# EAGLE design smallscale (EAGLE 6.4)

## Sheet 1 of 2
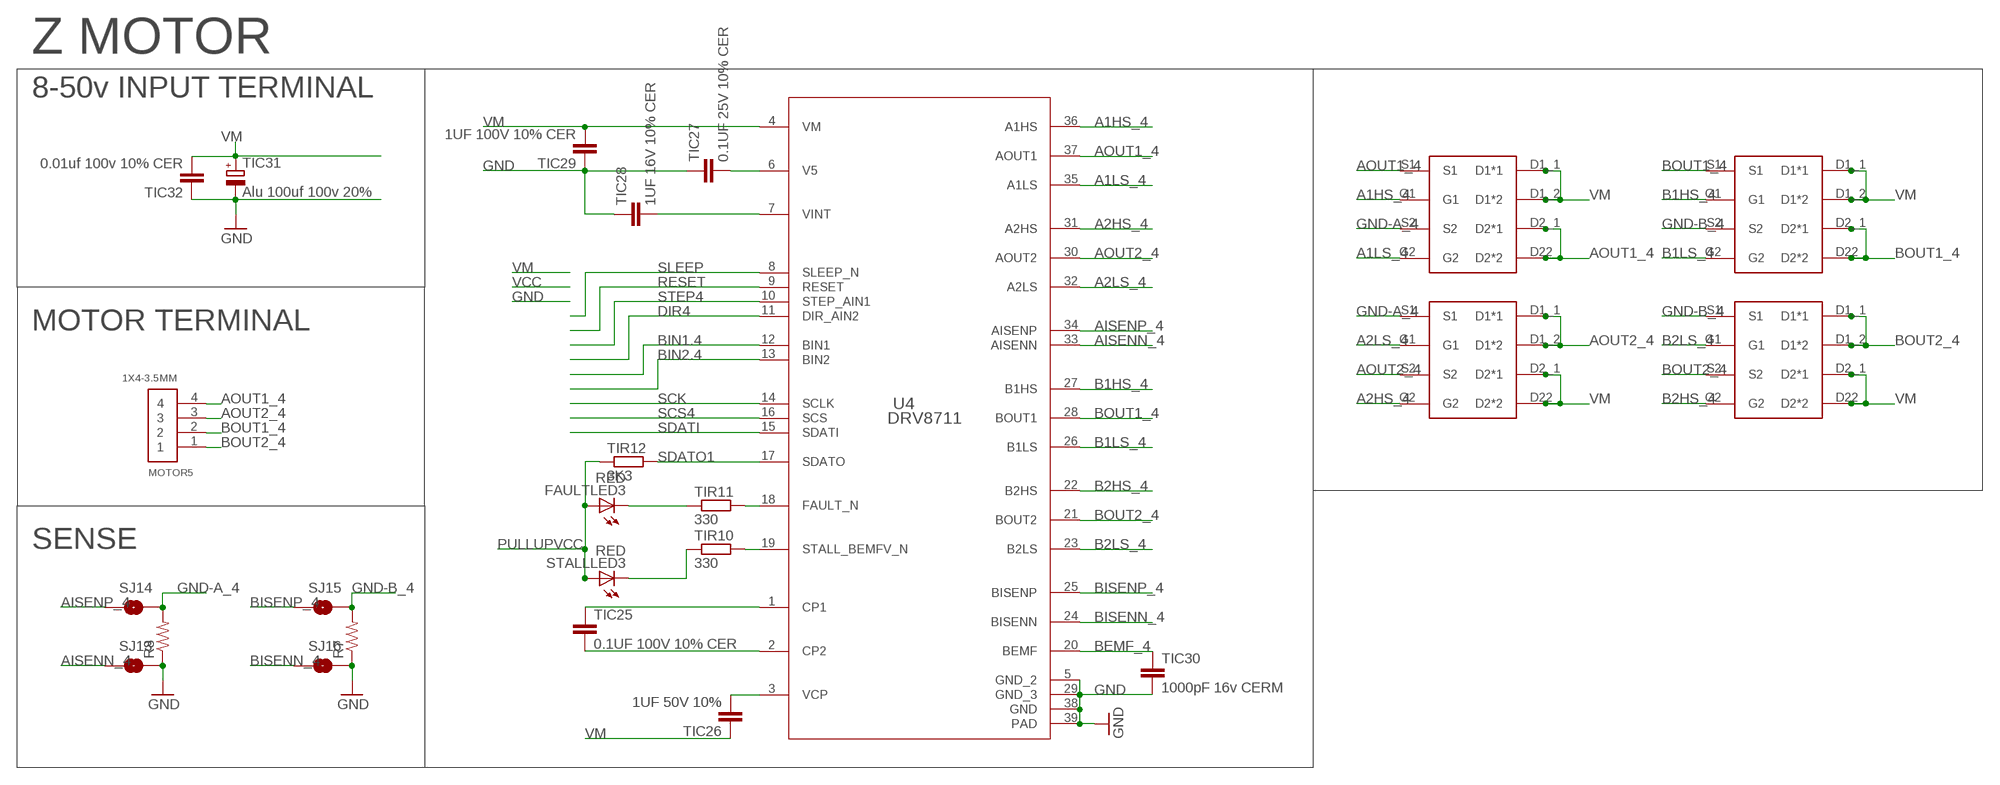
[diagram p0: schematic, sheet 1]

### Parts
FAULTLED3  RED  LEDSMT1206  [1206]
MOTOR5  1X4-3.5MM  [1X04-3.5MM]
R7  R-US_R2512  [R2512]
R8  R-US_R2512  [R2512]
SJ13  SOLDERJUMPERTRACE  [SJ_2S-TRACE]
SJ14  SOLDERJUMPERTRACE  [SJ_2S-TRACE]
SJ15  SOLDERJUMPERTRACE  [SJ_2S-TRACE]
SJ16  SOLDERJUMPERTRACE  [SJ_2S-TRACE]
STALLLED3  RED  LEDSMT1206  [1206]
TIC25  0.1UF 100V 10% CER  C-EUC0603K  [C0603K]
TIC26  1UF 50V 10%  C-EUC0805K  [C0805K]
TIC27  0.1UF 25V 10% CER  C-EUC0603K  [C0603K]
TIC28  1UF 16V 10% CER  C-EUC0603K  [C0603K]
TIC29  1UF 100V 10% CER  C-EUC1206K  [C1206K]
TIC30  1000pF 16v CERM  C-EUC0603K  [C0603K]
TIC31  Alu 100uf 100v 20%  CPOL-EUE5-10.5  [E5-10,5]
TIC32  0.01uf 100v 10% CER  C-EUC0603K  [C0603K]
TIR10  330  R-EU_R1206  [R1206]
TIR11  330  R-EU_R1206  [R1206]
TIR12  3K3  R-EU_R1206  [R1206]
U4  DRV8711  DRV8711DCPR  [DCP0038A_N]
U$13  CSD88537ND  [CSD88537ND]
U$14  CSD88537ND  [CSD88537ND]
U$15  CSD88537ND  [CSD88537ND]
U$16  CSD88537ND  [CSD88537ND]

### Nets
A1HS_4: U4.36(A1HS) U$13.G1
A1LS_4: U4.35(A1LS) U$13.G2
A2HS_4: U4.31(A2HS) U$15.G2
A2LS_4: U4.32(A2LS) U$15.G1
AISENN_4: SJ13.1 U4.33(AISENN)
AISENP_4: SJ14.1 U4.34(AISENP)
AOUT1_4: MOTOR5.4 U4.37(AOUT1) U$13.D2_1(D2*1) U$13.D22(D2*2) U$13.S1
AOUT2_4: MOTOR5.3 U4.30(AOUT2) U$15.D1_1(D1*1) U$15.D1_2(D1*2) U$15.S2
B1HS_4: U4.27(B1HS) U$14.G1
B1LS_4: U4.26(B1LS) U$14.G2
B2HS_4: U4.22(B2HS) U$16.G2
B2LS_4: U4.23(B2LS) U$16.G1
BEMF_4: TIC30.1 U4.20(BEMF)
BIN1.4: U4.12(BIN1)
BIN2.4: U4.13(BIN2)
BISENN_4: SJ16.1 U4.24(BISENN)
BISENP_4: SJ15.1 U4.25(BISENP)
BOUT1_4: MOTOR5.2 U4.28(BOUT1) U$14.D2_1(D2*1) U$14.D22(D2*2) U$14.S1
BOUT2_4: MOTOR5.1 U4.21(BOUT2) U$16.D1_1(D1*1) U$16.D1_2(D1*2) U$16.S2
CP1_4: TIC25.1 U4.1(CP1)
CP2_4: TIC25.2 U4.2(CP2)
DIR4: U4.11(DIR_AIN2)
FAULT_N4: TIR11.2 U4.18(FAULT_N)
FAULTLED4: FAULTLED3.C TIR11.1
GND: R7.1 R8.1 SJ13.2 SJ16.2 TIC27.1 TIC28.1 TIC29.1 TIC30.2 TIC31.- TIC32.1 U4.5(GND_2) U4.29(GND_3) U4.38(GND) U4.39(PAD) ; also sheet 2
GND-A_4: R8.2 SJ14.2 U$13.S2 U$15.S1
GND-B_4: R7.2 SJ15.2 U$14.S2 U$16.S1
PULLUPVCC: FAULTLED3.A STALLLED3.A TIR12.1
RESET: U4.9(RESET)
SCK: U4.14(SCLK)
SCS4: U4.16(SCS)
SDATI: U4.15(SDATI)
SDATO1: TIR12.2 U4.17(SDATO)
SLEEP: U4.8(SLEEP_N)
STALL_N4: TIR10.2 U4.19(STALL_BEMFV_N)
STALLLED4: STALLLED3.C TIR10.1
STEP4: U4.10(STEP_AIN1)
V5_4: TIC27.2 U4.6(V5)
VCP4: TIC26.2 U4.3(VCP)
VINT4: TIC28.2 U4.7(VINT)
VM: TIC26.1 TIC29.2 TIC31.+ TIC32.2 U4.4(VM) U$13.D1_1(D1*1) U$13.D1_2(D1*2) U$14.D1_1(D1*1) U$14.D1_2(D1*2) U$15.D2_1(D2*1) U$15.D22(D2*2) U$16.D2_1(D2*1) U$16.D22(D2*2) ; also sheet 2

### Notes on the sheet
- Z MOTOR
- 8-50v INPUT TERMINAL
- MOTOR TERMINAL
- SENSE

## Sheet 2 of 2
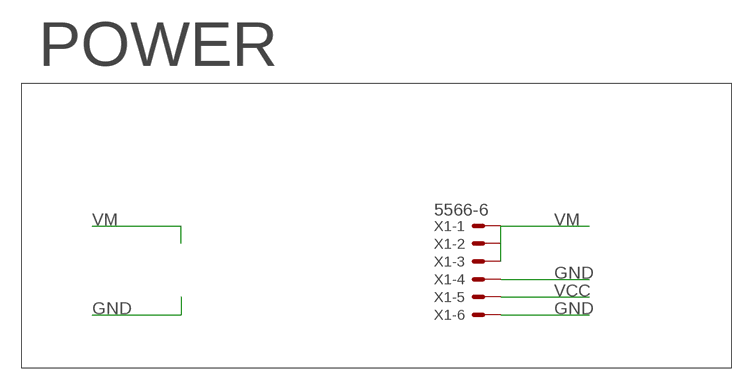
[diagram p1: schematic, sheet 2]

### Parts
X1  5566-6  [5566-6]

### Nets
GND: X1.4 X1.6 ; also sheet 1
VCC: X1.5 ; also sheet 1
VM: X1.1 X1.2 X1.3 ; also sheet 1

### Notes on the sheet
- POWER

## Library data of the parts
FAULTLED3 STALLLED3 = led:LED: LED OSRAM: - CHIPLED LG R971, LG N971, LY N971, LG Q971, LY Q971, LO R971, LY R971 LH N974, LH R974 LS Q976, LO Q976, LY Q976 LO Q996 - Hyper CHIPLED LW Q18S LB Q993, LB Q99A, LB R99A - SideLED LS A670, LO A670, LY A670, LG A670, LP A670 LB A673, LV A673, LT A673, LW A673 LH A674 LY A675 LS A676, LA A676, LO A676, LY A676, LW A676 LS A679, LY A679, LG A679 - Hyper Micro SIDELED® LS Y876, LA Y876, LO Y876, LY Y876 LT Y87S - SmartLED LW L88C, LW L88S LB L89C, LB L89S, LG L890 LS L89K, LO L89K, LY L89K LS L896, LA L896, LO L896, LY L896 - TOPLED LS T670, LO T670, LY T670, LG T670, LP T670 LSG T670, LSP T670, LSY T670, LOP T670, LYG T670 LG T671, LOG T671, LSG T671 LB T673, LV T673, LT T673, LW T673 LH T674 LS T676, LA T676, LO T676, LY T676, LB T676, LH T676, LSB T676, LW T676 LB T67C, LV T67C, LT T67C, LS T67K, LO T67K, LY T67K, LW E67C LS E67B, LA E67B, LO E67B, LY E67B, LB E67C, LV E67C, LT E67C LW T67C LS T679, LY T679, LG T679 LS T770, LO T770, LY T770, LG T770, LP T770 LB T773, LV T773, LT T773, LW T773 LH T774 LS E675, LA E675, LY E675, LS T675 LS T776, LA T776, LO T776, LY T776, LB T776 LHGB T686 LT T68C, LB T68C - Hyper Mini TOPLED® LB M676 - Mini TOPLED Santana® LG M470 LS M47K, LO M47K, LY M47K Source: http://www.osram.convergy.de LUXEON: - LUMILED® LXK2-PW12-R00, LXK2-PW12-S00, LXK2-PW14-U00, LXK2-PW14-V00 LXK2-PM12-R00, LXK2-PM12-S00, LXK2-PM14-U00 LXK2-PE12-Q00, LXK2-PE12-R00, LXK2-PE12-S00, LXK2-PE14-T00, LXK2-PE14-U00 LXK2-PB12-K00, LXK2-PB12-L00, LXK2-PB12-M00, LXK2-PB14-N00, LXK2-PB14-P00, LXK2-PB14-Q00 LXK2-PR12-L00, LXK2-PR12-M00, LXK2-PR14-Q00, LXK2-PR14-R00 LXK2-PD12-Q00, LXK2-PD12-R00, LXK2-PD12-S00 LXK2-PH12-R00, LXK2-PH12-S00 LXK2-PL12-P00, LXK2-PL12-Q00, LXK2-PL12-R00 Source: www.luxeon.com KINGBRIGHT: KA-3528ASYC Source: www.kingbright.com
MOTOR5 = adafruit:1X4: 4-pin connector
R7 R8 = adafruit:R-US_: RESISTOR, American symbol
SJ13-SJ16 = SparkFun:SOLDERJUMPER: Solder Jumper Standard SMD solder jumper. Used to automate production. Two varients : Normally Open and Normally Closed are the same, but have different paste layers. NC will have a large amount of paste and should jumper during reflow.
TIC25-TIC30 TIC32 = rcl:C-EU: CAPACITOR, European symbol
TIC31 = resistor:CPOL-EU: POLARIZED CAPACITOR, European symbol
TIR10-TIR12 = rcl:R-EU_: RESISTOR, European symbol
U4 = tidrv8711:DRV8711DCPR; ALTERNATEPARTNUMBER: DRV8711DCP; COMPTYPE: IC; MANUFACTURER: Texas Instruments; MOUNTTYPE: SMT; PACKAGEREFERENCE: DCP0038A; PARTNUMBER: DRV8711DCPR; PIN_COUNT: 39; REFDES: RefDes; ROHS: Y; TYPE: TYPE; VALUE: Value
U$13-U$16 = tidrv8711:CSD88537ND
X1 = con-molex:5566-6: Mini FIT connector 6 pol Source: http://www.molex.com; MPN: 95566-61002; OC_FARNELL: unknown; OC_NEWARK: 22K8620

## Board
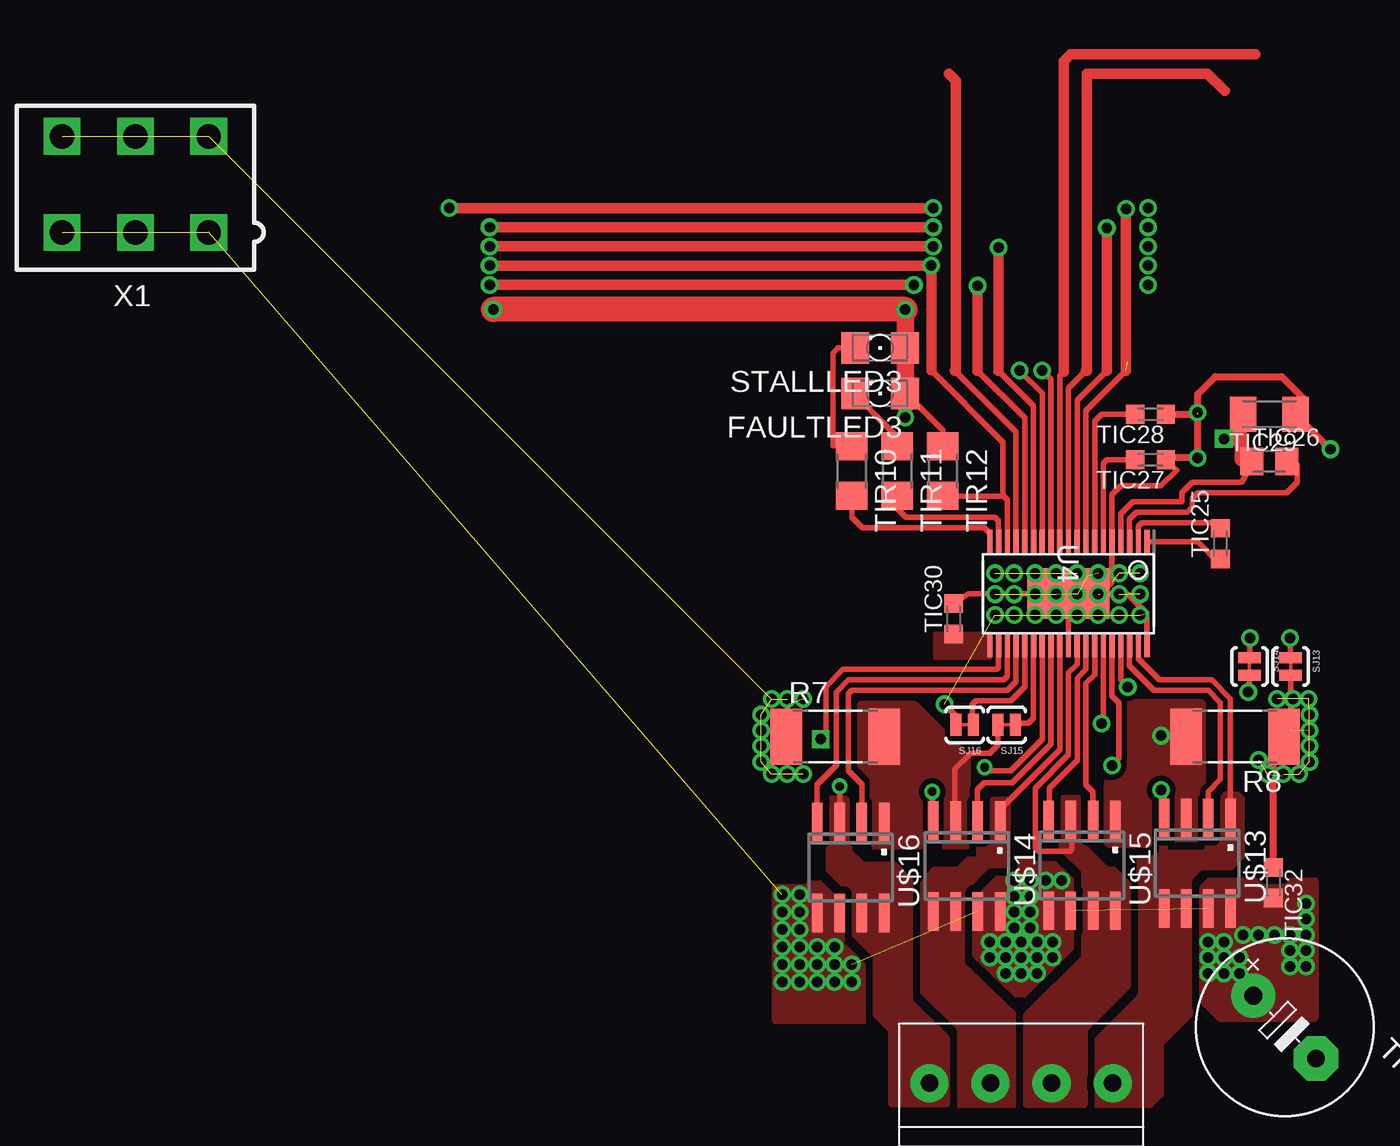
[diagram p2: board, top side]
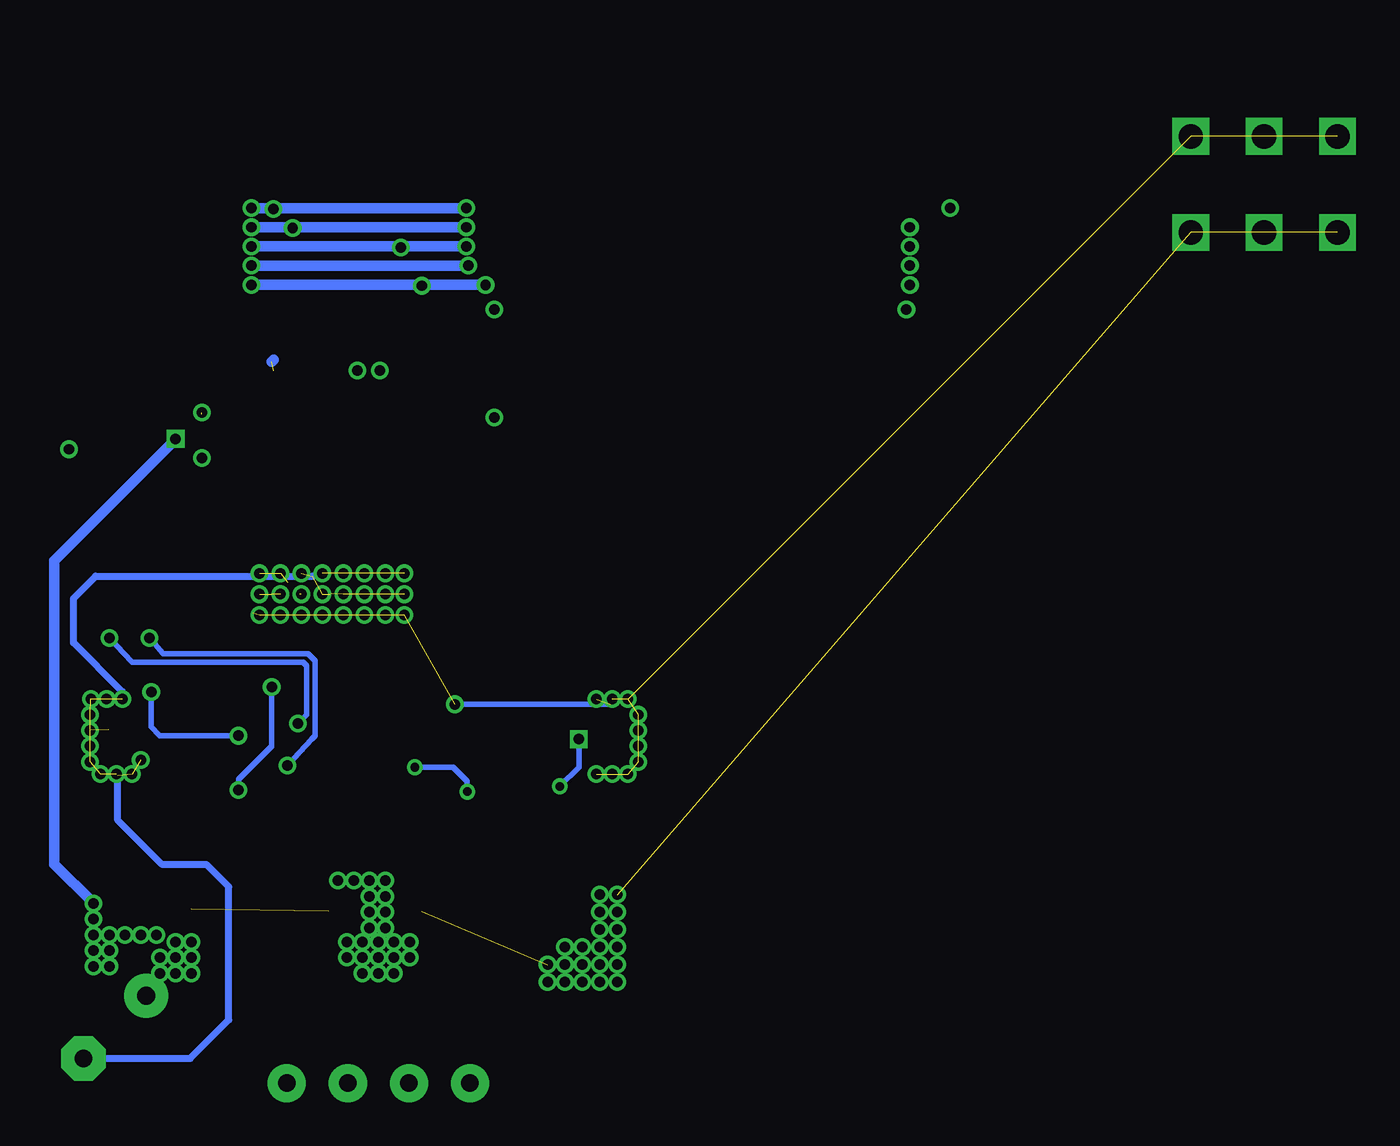
[diagram p3: board, bottom side, seen from below]

No outline drawn. Coordinates in mm, seen from the top.
Copper layers (1*16): Top 0.035mm / dielectric 1.5mm / Bottom 0.035mm
Design rules "default": minimum track width 10mil, minimum drill 24mil, track to track 8mil, track to pad 8mil, pad to pad 8mil, via to via 8mil, smd to smd 8mil, copper to edge 40mil, drill to drill 8mil, minimum pad ring 10mil, minimum via ring 8mil, stop-mask expansion 4mil, vias tented up to drill 0mil, thermal gap 10mil

### Footprints (pad centres in the part's own frame; a part is rotated, then mirrored left to right if it is on the bottom)
1206 = smd 1.6 x 1.803: A -1.422,0; C 1.422,0
1X04-3.5MM = drill 1 pad 2.184: 1 -5.25,0; 2 -1.75,0; 3 1.75,0; 4 5.25,0
R2512 = smd 1.8 x 3.2: 1 -2.8,0; 2 2.8,0
SJ_2S-TRACE = smd 0.635 x 1.27: 1 -0.508,0; 2 0.508,0
C0603K = smd 1.05 x 1.08: 1 -0.875,0; 2 0.875,0
C0805K = smd 1.3 x 1.6: 1 -1,0; 2 1,0
C1206K = smd 1.5 x 2: 1 -1.5,0; 2 1.5,0
E5-10,5 = drill 1.016 pad 2.54: + -2.54,0 | drill 1.016 pad 2.54 octagon: - 2.54,0
R1206 = smd 1.6 x 1.803: 1 -1.422,0; 2 1.422,0
DCP0038A_N = smd 1.397 x 0.305: 1 -2.95,4.5; 2 -2.95,4; 3 -2.95,3.5; 4 -2.95,3; 5 -2.95,2.5; 6 -2.95,2; 7 -2.95,1.5; 8 -2.95,1; 9 -2.95,0.5; 10 -2.95,0; 11 -2.95,-0.5; 12 -2.95,-1; 13 -2.95,-1.5; 14 -2.95,-2; 15 -2.95,-2.5; 16 -2.95,-3; 17 -2.95,-3.5; 18 -2.95,-4; 19 -2.95,-4.5; 20 2.95,-4.5; 21 2.95,-4; 22 2.95,-3.5; 23 2.95,-3; 24 2.95,-2.5; 25 2.95,-2; 26 2.95,-1.5; 27 2.95,-1; 28 2.95,-0.5; 29 2.95,0; 30 2.95,0.5; 31 2.95,1; 32 2.95,1.5; 33 2.95,2; 34 2.95,2.5; 35 2.95,3; 36 2.95,3.5; 37 2.95,4; 38 2.95,4.5 | smd 2.896 x 4.699: 39 0,0
CSD88537ND = smd 0.6 x 2.2: D1_1 0.635,6.41; D1_2 1.905,6.41; D2_1 3.175,6.41; D22 4.445,6.41; G1 1.905,1.21; G2 4.445,1.21; S1 0.635,1.21; S2 3.175,1.21
5566-6 = drill 1.4 square: 1 4.2,-2.75; 2 0,-2.75; 3 -4.2,-2.75; 4 4.2,2.75; 5 0,2.75; 6 -4.2,2.75

### Placement (x,y rotation side)
FAULTLED3  16.37,46.03 180 top
MOTOR5  24.45,6.54 0 top
R7  13.8,26.38 0 top
R8  36.7,26.38 180 top
SJ13  39.88,30.39 270 top
SJ14  37.53,30.39 270 top
SJ15  23.62,27.05 180 top
SJ16  21.22,27.05 180 top
STALLLED3  16.37,48.64 180 top
TIC25  35.86,37.43 90 top
TIC26  38.66,42.13 0 top
TIC27  31.86,42.23 180 top
TIC28  31.86,44.83 180 top
TIC29  38.66,44.83 180 top
TIC30  20.59,33.12 90 top
TIC31  39.54,9.75 315 top
TIC32  38.9,18.02 270 top
TIR10  14.75,41.59 270 top
TIR11  17.36,41.59 270 top
TIR12  19.97,41.59 270 top
U4  27.16,34.57 270 top
U$13  37.07,22.94 180 top
U$14  23.87,22.78 180 top
U$15  30.47,22.82 180 top
U$16  17.23,22.7 180 top
X1  -26.28,58 0 top

### Tracks (layer width: path | path; a pad name or v marks a point on that pad's centre or on a via)
A1HS_4
  Top 0.305: U$13.G1 35.16,23.23 35.86,23.93 35.86,28.33 35.16,29.03 32.06,29.03 30.66,30.43 30.66,32.22 U4.36
A1LS_4  (via drill 0.6)
  Top 0.305: U4.35 30.16,29.63 v30.56,29.23 | v32.46,23.33 32.46,23.13 32.66,22.93 32.66,21.77 U$13.G2
  Bottom 0.305: v30.56,29.23 30.56,25.83 32.46,23.93 v32.46,23.33
A2HS_4
  Top 0.305: U$15.G2 26.06,21.64 26.06,23.43 27.66,25.03 27.66,29.73 28.16,30.23 U4.31
A2LS_4
  Top 0.305: U4.32 28.66,29.93 28.16,29.43 28.16,23.63 28.56,23.23 U$15.G1
AISENN_4  (via drill 0.6)
  Top 0.305: U4.33 29.16,27.23 v29.06,27.13 | v39.86,32.03 39.86,30.92 SJ13.1
  Bottom 0.305: v39.86,32.03 38.56,30.63 28.76,30.63 28.56,30.43 28.56,27.63 v29.06,27.13
AISENP_4  (via drill 0.6)
  Top 0.305: v37.56,32.03 37.56,30.93 SJ14.1 | U4.34 29.66,28.73 30.06,28.33 30.06,25.13 v29.66,24.73
  Bottom 0.305: v37.56,32.03 36.76,31.13 28.46,31.13 28.06,30.73 28.06,26.43 28.26,26.23 v29.66,24.73
AOUT1_4
  Top 0.305: U$13.S1 36.44,28.55 35.36,29.63 32.36,29.63 31.16,30.83 U4.37
  pour Top (isolate 0.406, rank 3, no thermals): 36.86,23.03 36.16,23.03 35.96,22.83 35.96,20.23 35.66,19.93 31.26,19.93 31.26,11.83 28.66,9.03 28.66,5.33 31.86,5.33 32.46,5.93 32.46,8.83 34.56,10.93 34.56,14.83 34.36,15.03 34.36,18.33 34.86,18.83 36.36,18.83 37.06,19.53 37.06,22.83
AOUT2_4
  Top 0.305: U$15.S2 27.36,21.55 27.36,19.93 27.26,19.83 25.46,19.83 25.26,20.03 25.26,23.43 27.16,25.33 27.16,30.03 27.66,30.53 U4.30
  pour Top (isolate 0.406, no thermals): 27.76,22.83 26.86,22.83 26.76,22.73 26.76,20.03 28.06,18.73 28.06,13.73 24.76,10.43 24.76,5.33 28.06,5.33 28.06,9.63 30.56,12.13 30.56,17.93 29.76,18.73 29.36,18.73 27.96,20.13 27.96,22.63
B1HS_4
  Top 0.305: U4.27 26.16,25.93 23.96,23.73 22.36,23.73 21.96,23.33 U$14.G1
B1LS_4  (via drill 0.5)
  Top 0.305: U4.26 25.66,26.23 23.86,24.43 22.56,24.43 v22.36,24.63 | v19.36,23.23 19.36,21.64 U$14.G2
  Bottom 0.305: v22.36,24.63 20.16,24.63 19.36,23.83 v19.36,23.23
B2HS_4
  Top 0.305: U4.22 23.66,29.83 23.46,29.63 14.56,29.63 13.86,28.93 13.86,24.73 12.76,23.63 12.76,21.52 U$16.G2
B2LS_4
  Top 0.305: U$16.G1 15.32,23.66 14.56,24.43 14.56,28.83 14.76,29.03 23.66,29.03 24.16,29.53 24.16,32.22 U4.23
BEMF_4
  pour Top (no thermals): 22.66,30.93 19.56,30.93 19.56,32.23 22.66,32.23
BIN1.4  (via drill 0.6)
  Top 0.305: U4.12 26.16,46.83 v25.66,47.33
BIN2.4  (via drill 0.6)
  Top 0.305: U4.13 25.66,46.03 v24.36,47.33
BISENN_4
  Top 0.305: U4.24 24.66,29.23 23.86,28.43 21.86,28.43 21.66,28.23 21.66,27.2 SJ16.1
BISENP_4
  Top 0.305: U4.25 25.16,27.43 24.86,27.13 24.15,27.13 SJ15.1
BOUT1_4
  Top 0.305: U4.28 26.66,25.63 23.26,22.23 23.26,21.59 U$14.S1
  pour Top (isolate 0.406, rank 3, no thermals): 23.66,22.73 22.86,22.73 22.66,22.53 22.66,20.13 22.26,20.13 20.86,18.73 19.46,18.73 18.76,17.83 18.76,11.53 20.86,9.43 20.86,5.33 24.06,5.33 24.06,10.43 21.46,12.93 21.06,13.33 21.06,17.53 22.56,19.03 23.46,19.03 23.66,19.23
BOUT2_4  (via drill 0.5, 0.6)
  Top 0.305: U4.21 23.16,30.33 23.06,30.23 14.26,30.23 13.26,29.23 13.26,26.53 v12.96,26.23 | v14.06,23.53 U$16.S2
  Bottom 0.305: v12.96,26.23 12.96,24.63 v14.06,23.53
  pour Top (isolate 0.406, no thermals): 14.56,22.63 14.56,19.83 15.36,19.03 17.16,19.03 18.06,18.13 18.06,11.23 20.16,9.13 20.16,5.33 17.06,5.33 17.06,9.53 16.16,10.43 16.16,13.83 14.96,15.03 14.96,17.23 13.46,18.73 13.46,22.73 13.56,22.83 14.36,22.83
CP1_4
  Top 0.305: TIC25.1 35.86,36.23 34.56,37.53 U4.1
CP2_4
  Top 0.305: U4.2 31.16,38.43 31.36,38.63 35.56,38.63 TIC25.2
DIR4
  Top 0.305: U4.11 26.66,47.03 26.89,47.26 26.96,47.33
  Top 0.61: 26.89,47.26 26.91,47.28 26.91,65.04 27.31,65.44 37.85,65.44
FAULT_N4
  Top 0.305: U4.18 23.16,38.73 22.96,38.93 17.86,38.93 17.36,39.43 TIR11.2
FAULTLED4
  Top 0.305: TIR11.1 17.36,43.53 15.96,44.93 15.06,45.92 FAULTLED3.C
GND  (via drill 0.6)  (48 unrouted)
  Top 0.305: SJ16.2 20.71,27.58 v20.06,28.23 | v11.06,28.53 11.06,26.44 R7.1 | SJ13.2 39.88,26.76 R8.1 | U4.38 31.66,33.43 30.56,34.53 28.96,34.53 | 28.96,34.53 27.2,34.53 U4.39 | U4.29 U4.39 | U4.39 21.44,34.57 TIC30.2 | 28.96,34.53 29.66,35.23 U4.5 29.66,40.23 30.16,40.73 32.46,40.73 33.36,41.63 TIC27.1
  Top 0.406: TIC28.1 34.56,44.83 | TIC27.1 32.73,42.33 v34.56,42.33 34.56,44.83 | 34.56,44.83 34.56,45.99 35.56,46.99 39.37,46.99 40.64,45.72 40.64,45.31 TIC29.1 v42.16,42.83 | TIC32.1 38.9,25.78 R8.1
  Bottom 0.305: v20.06,28.23 11.16,28.23 v11.06,28.53
  Bottom 0.406: v39.11,28.54 39.11,28.95 41.91,31.75 41.91,34.29 40.64,35.56 28.23,35.56 v27.66,35.73 | TIC31.- 35.23,7.95 33.02,10.16 33.02,17.78 34.29,19.05 36.83,19.05 39.37,21.59 39.37,24.14 v39.46,24.23
  other vias: 9.56,27.63 9.56,26.73 9.56,25.83 9.56,24.93 10.16,24.23 11.06,24.23 11.96,24.23 10.16,28.53 11.96,28.53 38.06,25.03 38.56,24.23 40.36,24.23 40.96,24.93 40.96,25.83 40.96,26.73 40.96,27.63 27.66,33.33 26.46,33.33 25.26,33.33 24.06,33.33 22.96,33.33 28.86,33.33 30.06,33.33 31.26,33.33 27.66,34.53 26.46,34.53 25.26,34.53 24.06,34.53 22.96,34.53 28.86,34.53 30.06,34.53 31.26,34.53 26.46,35.73 25.26,35.73 24.06,35.73 22.96,35.73 30.06,35.73 31.26,35.73 28.86,35.73 34.56,44.93 40.91,28.54 40.01,28.54
GND-A_4  (via drill 0.6)
  Top 0.305: SJ14.2 37.53,29.1 v37.46,28.93 | v32.46,26.43 33.85,26.43 R8.2
  Bottom 0.305: v37.46,28.93 37.46,26.93 36.96,26.43 v32.46,26.43
  pour Top (isolate 0.305, no thermals): 29.46,20.23 31.76,20.23 31.76,23.93 33.26,23.93 33.26,20.53 34.56,20.53 34.56,23.43 34.86,23.73 34.86,28.23 34.76,28.33 30.06,28.33 29.66,27.93 29.66,24.03 29.36,23.73 29.36,20.33
GND-B_4
  Top 0.305: SJ15.2 23.11,25.88 22.66,25.43 21.56,25.43 20.66,24.53 20.66,21.61 U$14.S2
  pour Top (isolate 0.305, no thermals): 21.36,20.13 21.36,25.23 18.36,28.23 15.26,28.23 15.26,24.73 15.96,24.03 15.96,20.13 18.66,20.13 18.66,23.83 20.06,23.83 20.06,20.13
PULLUPVCC  (via drill 0.6)
  Top 0.305: TIR12.1 19.97,43.92 18.56,45.33 18.49,45.33 FAULTLED3.A | STALLLED3.A 17.59,49.02 17.81,48.84 17.81,45.34
  Top 0.406: 18.49,45.33 17.81,45.33 17.81,45.34
  Top 0.813: v17.81,44.64 17.81,45.34
  Top 1.016: 17.81,45.34 v17.81,50.84
  Top 1.422: v17.81,50.84 v-5.79,50.84
RESET  (via drill 0.6)
  Top 0.305: U4.9 27.66,45.63 29.36,47.33
  Top 0.61: 29.36,47.33 v29.36,55.49 | v19.41,55.54 v-5.99,55.54
  Bottom 0.61: 29.31,55.54 v31.71,55.54 | v29.36,55.49 29.31,55.54 | 29.31,55.54 v19.41,55.54
SCK  (via drill 0.6)
  Top 0.305: U4.14 25.16,45.33 23.16,47.33
  Top 0.61: 23.16,47.33 v23.16,54.39 | v19.41,54.44 v-5.99,54.44
  Bottom 0.61: v23.16,54.39 23.01,54.44 | v31.71,54.44 23.01,54.44 | 23.01,54.44 v19.41,54.44
SCS4
  Top 0.305: U4.16 24.16,43.83 20.66,47.33
  Top 0.61: 20.31,64.34 20.71,63.94 20.71,47.33 20.66,47.33
SDATI  (via drill 0.6)
  Top 0.305: U4.15 24.66,44.63 21.96,47.33
  Top 0.61: 21.96,47.33 v21.96,52.19 | v18.31,52.24 v-5.99,52.24
  Bottom 0.61: v21.96,52.19 22.01,52.24 | v31.71,52.24 22.01,52.24 | 22.01,52.24 v18.31,52.24
SDATO1  (via drill 0.6)
  Top 0.305: U4.17 23.66,39.93 23.46,40.13 | 23.46,40.13 20.01,40.13 TIR12.2 | 19.31,47.34 23.41,43.24 23.41,40.18 23.46,40.13
  Top 0.61: 19.31,47.34 v19.31,53.34 v-5.99,53.34
  Bottom 0.61: v31.71,53.34 v19.31,53.34
SLEEP  (via drill 0.6)  (1 unrouted)
  Top 0.305: U4.8 28.16,45.03 30.46,47.33
  Top 0.61: 30.46,47.33 v30.46,56.59 | v19.41,56.64 v-8.29,56.64 -7.2,56.63 -7.19,56.62
  Bottom 0.61: v30.46,56.59 30.51,56.64 | 30.51,56.64 v31.71,56.64 | 30.51,56.64 v19.41,56.64 | 30.56,47.84 30.46,47.94
STALL_N4
  Top 0.305: U4.19 22.66,38.03 22.36,38.33 15.36,38.33 14.76,38.93 14.76,40.16 TIR10.2
STALLLED4
  Top 0.305: TIR10.1 14.08,43.01 13.66,43.03 13.66,48.33 13.96,48.63 14.94,48.63 STALLLED3.C
STEP4
  Top 0.305: U4.10 27.16,46.33 28.06,47.23 | 28.06,47.33 28.06,47.23 | 28.06,47.23 28.16,47.33
  Top 0.61: 28.16,47.33 28.21,47.33 28.21,64.34 35.11,64.34 36.11,63.34
V5_4
  Top 0.305: U4.6 29.16,42.03 29.36,42.23 TIC27.2
VCP4
  Top 0.305: U4.3 30.66,38.83 31.06,39.23 33.96,39.23 34.26,39.53 34.26,40.03 34.56,40.33 39.66,40.33 40.26,40.93 40.26,41.93 TIC26.2
VINT4
  Top 0.305: U4.7 28.66,44.43 29.06,44.83 TIC28.2
VM  (via drill 0.6)  (5 unrouted)
  Top 0.305: U4.4 30.16,39.13 30.86,39.83 33.66,39.83 33.66,40.33 34.26,40.93 37.06,40.93 37.16,41.03 TIC26.1
  Top 0.813: v36.06,43.43 36.96,43.43 | 36.96,43.43 37.06,43.33 37.06,43.14 | 37.06,43.14 37.06,42.23 TIC26.1 | 36.96,43.43 36.96,44.63 TIC29.2 | 36.77,43.43 37.06,43.14
  Bottom 0.61: v36.06,43.43 36.06,43.39 43.01,36.44 43.01,19.08 v40.76,16.83
  other vias: 40.76,15.03 38.96,15.03 40.76,14.13 38.06,15.03 39.86,14.13 36.96,12.83 36.96,13.73 36.06,13.73 36.06,12.83 24.96,15.43 25.36,14.63 24.46,14.63 23.56,14.63 26.26,14.63 24.96,16.33 25.36,13.73 24.46,13.73 23.56,13.73 26.26,13.73 24.06,15.43 40.76,15.93 39.86,15.03 13.76,14.33 12.76,14.33 11.76,14.33 10.76,14.33 14.76,13.33 13.76,13.33 12.76,13.33 11.76,12.33 10.76,13.33 37.16,15.03 10.76,15.33 10.76,16.33 10.76,17.33 11.76,17.33 11.76,16.33 11.76,15.33 24.46,12.83 23.56,12.83 25.36,12.83 24.06,16.33 22.66,14.63 22.66,13.73 36.06,14.63 40.76,13.23 39.86,13.23 35.16,14.63 35.16,13.73 35.16,12.83 24.06,17.23 24.06,18.13 24.96,17.23 24.96,18.13 25.86,18.13 26.76,18.13 14.76,12.33 13.76,12.33 12.76,12.33 11.76,13.33 10.76,12.33
  pour Top (isolate 0.406, rank 4, no thermals): 27.46,17.73 27.46,14.03 25.06,11.63 23.66,11.63 21.66,13.63 21.66,17.23 22.66,18.23 23.66,18.23 24.16,18.73 24.16,19.13 24.26,19.23 26.56,19.23 27.26,18.53 27.26,17.93
  pour Top (isolate 0.406, rank 2, no thermals): 41.26,10.23 35.86,10.23 34.86,11.23 34.86,17.73 35.26,18.13 41.26,18.13
  pour Top (isolate 0.406, rank 5, no thermals): 14.26,17.93 12.36,17.93 12.16,17.73 10.36,17.73 10.36,10.13 15.56,10.13 15.56,10.63 15.46,13.63 14.36,14.73 14.36,17.83